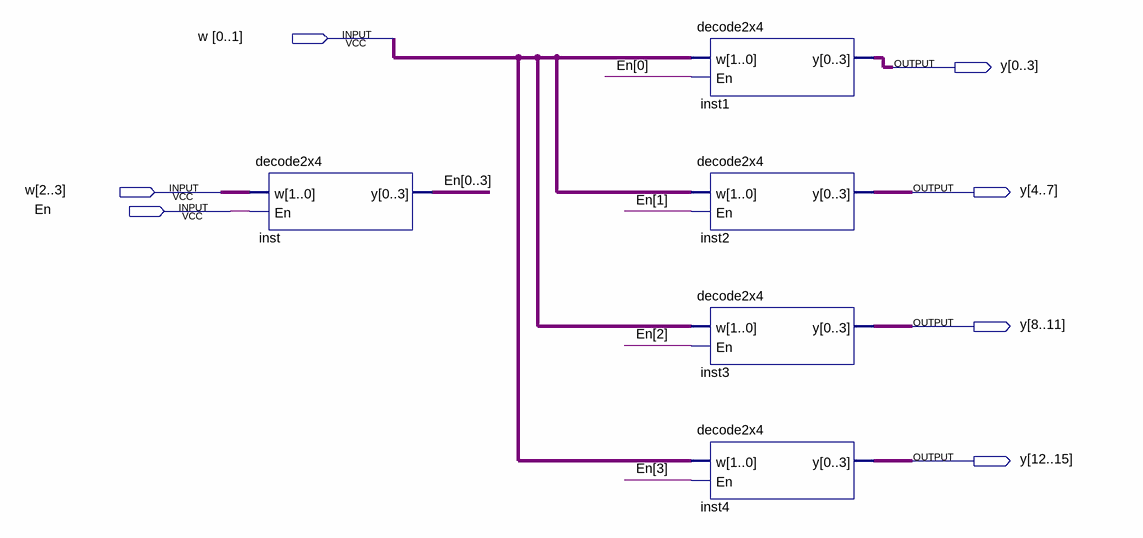
[diagram p0: schematic sheet]
// Quartus schematic decode4x16.bdf as structural Verilog: 5 symbols, 7 pins
module decode4x16 (
  input  [0:3] w,
  input  En,
  output [0:15] y
);

  wire [3:0] En_bus;

  decode2x4 inst (.w(w[2:3]), .En(En), .y({En_bus[0], En_bus[1], En_bus[2], En_bus[3]}));
  decode2x4 inst1 (.w(w[0:1]), .En(En_bus[0]), .y(y[0:3]));
  decode2x4 inst2 (.w(w[0:1]), .En(En_bus[1]), .y(y[4:7]));
  decode2x4 inst3 (.w(w[0:1]), .En(En_bus[2]), .y(y[8:11]));
  decode2x4 inst4 (.w(w[0:1]), .En(En_bus[3]), .y(y[12:15]));
endmodule
